# Altium schematic sheet GPIO_SW.SchDoc: GPIO Switches
size A; Author: James Thomas; CompanyName: BYUI; DrawnBy: James Thomas; Engineer: James Thomas; Organization: CSEE; DocumentNumber: 11; Revision: 0.0.1; SheetNumber: 11; SheetTotal: 15
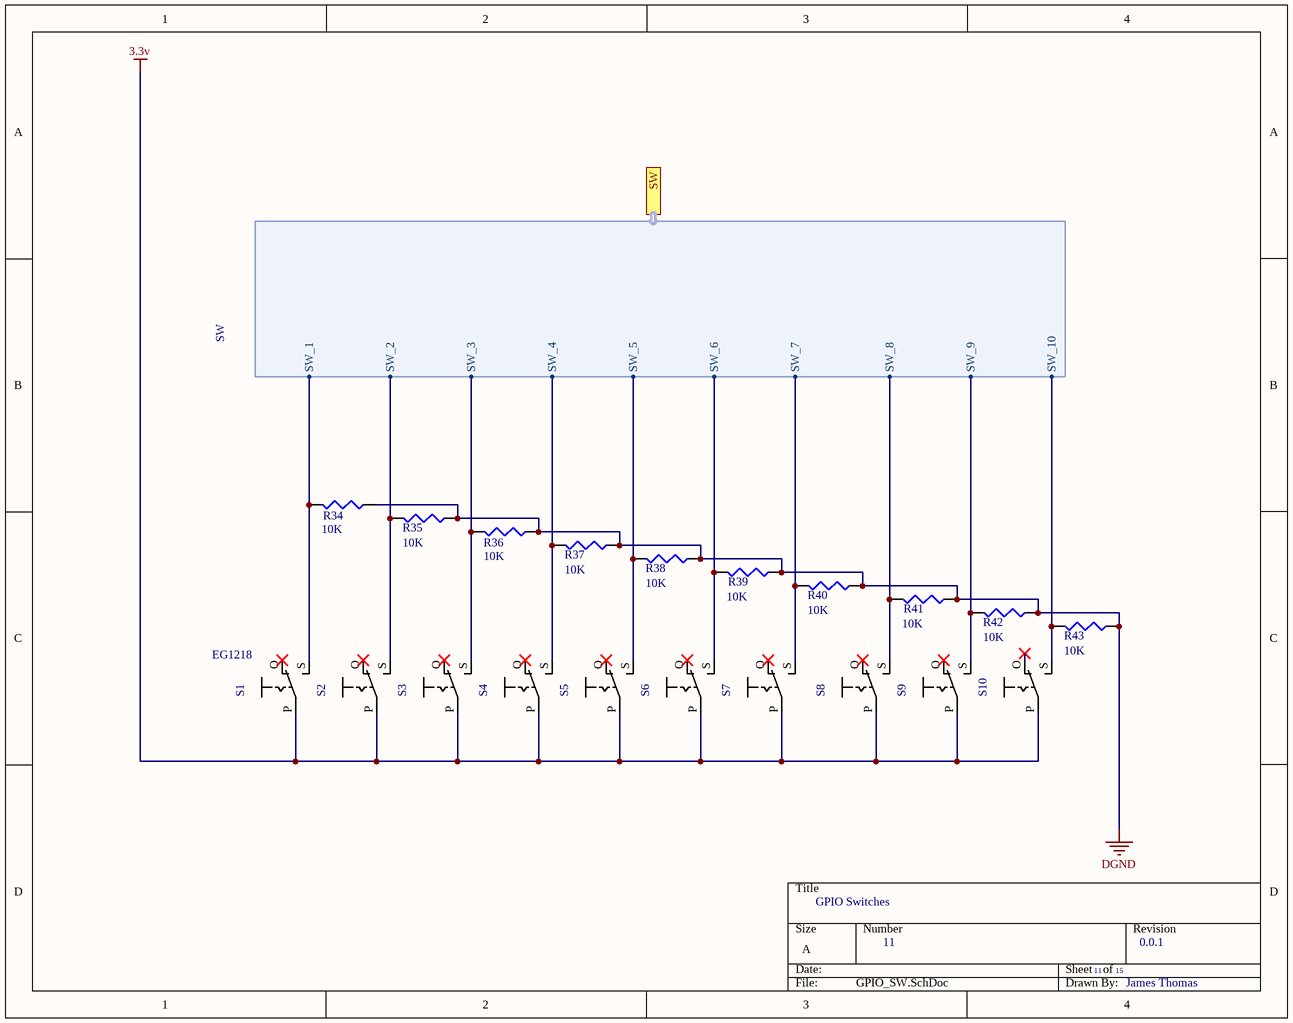
[diagram p0: GPIO_SW.SchDoc]

## Parts
R34  value 10K  [J1-0603]  (hidden comment: Res3)
R35  value 10K  [J1-0603]  (hidden comment: Res3)
R36  value 10K  [J1-0603]  (hidden comment: Res3)
R37  value 10K  [J1-0603]  (hidden comment: Res3)
R38  value 10K  [J1-0603]  (hidden comment: Res3)
R39  value 10K  [J1-0603]  (hidden comment: Res3)
R40  value 10K  [J1-0603]  (hidden comment: Res3)
R41  value 10K  [J1-0603]  (hidden comment: Res3)
R42  value 10K  [J1-0603]  (hidden comment: Res3)
R43  value 10K  [J1-0603]  (hidden comment: Res3)
S1  EG1218  [*EG1218_EG1218(Primary)]
S2  EG1218  [*EG1218_EG1218(Primary)]  (value not drawn)
S3  EG1218  [*EG1218_EG1218(Primary)]  (value not drawn)
S4  EG1218  [*EG1218_EG1218(Primary)]  (value not drawn)
S5  EG1218  [*EG1218_EG1218(Primary)]  (value not drawn)
S6  EG1218  [*EG1218_EG1218(Primary)]  (value not drawn)
S7  EG1218  [*EG1218_EG1218(Primary)]  (value not drawn)
S8  EG1218  [*EG1218_EG1218(Primary)]  (value not drawn)
S9  EG1218  [*EG1218_EG1218(Primary)]  (value not drawn)
S10  EG1218  [*EG1218_EG1218(Primary)]  (value not drawn)

## Ports
SW (harness SW)

## Harnesses
SW: SW_1, SW_2, SW_3, SW_4, SW_5, SW_6, SW_7, SW_8, SW_9, SW_10

## Nets
3.3v: S1.P S2.P S3.P S4.P S5.P S6.P S7.P S8.P S9.P S10.P
DGND: R34.1 R35.1 R36.1 R37.1 R38.1 R39.1 R40.1 R41.1 R42.1 R43.1
NetR34_2: R34.2 S1.S ; port SW.SW_1
NetR35_2: R35.2 S2.S ; port SW.SW_2
NetR36_2: R36.2 S3.S ; port SW.SW_3
NetR37_2: R37.2 S4.S ; port SW.SW_4
NetR38_2: R38.2 S5.S ; port SW.SW_5
NetR39_2: R39.2 S6.S ; port SW.SW_6
NetR40_2: R40.2 S7.S ; port SW.SW_7
NetR41_2: R41.2 S8.S ; port SW.SW_8
NetR42_2: R42.2 S9.S ; port SW.SW_9
NetR43_2: R43.2 S10.S ; port SW.SW_10

Not connected (* = marked no-connect by the designer): S1 O*; S2 O*; S3 O*; S4 O*; S5 O*; S6 O*; S7 O*; S8 O*; S9 O*; S10 O*

## Library data of the parts
R34-R43 = Res3: Resistor; Published: 8-Jun-2000; LatestRevisionDate: 29-May-2009; LatestRevisionNote: IPC-7351 Footprint Added.; PackageReference: J1-0603; Publisher: Altium Limited; PackageDescription: Chip Resistor
S1-S10 = EG1218: Slide Switch SPDT Through Hole; MF: E-Switch; Package: FakePackage u; Digi-Key_Part_Number: EG1903-ND; MP: EG1218; SnapEDA_Link: https://www.snapeda.com/parts/EG1218/E-Switch/view-part/13895/?ref=snap; Digi-Key_Purchase_URL: https://www.digikey.com/product-detail/en/e-switch/EG1218/EG1903-ND/101726?utm_source=snapeda&utm_medium=aggregator&utm_campaign=symbol; Value: *